# EAGLE schematic counter_toy (EAGLE 9.6.2)
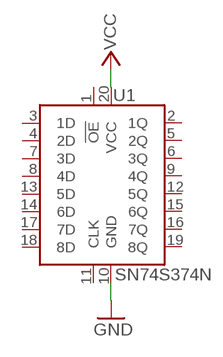
[diagram p0: schematic, sheet 1]

## Parts
U1  SN74S374N  [DIP762W53P254L2540H508Q20B]

## Nets
GND: U1.10(GND)
VCC: U1.20(VCC)
Unconnected: U1.1(!OE) U1.2(1Q) U1.3(1D) U1.4(2D) U1.5(2Q) U1.6(3Q) U1.7(3D) U1.8(4D) U1.9(4Q) U1.11(CLK) U1.12(5Q) U1.13(5D) U1.14(6D) U1.15(6Q) U1.16(7Q) U1.17(7D) U1.18(8D) U1.19(8Q)

## Library data of the parts
U1 = ellajameson-core:SN74S374